# EAGLE design UL-16 (EAGLE 4.11)
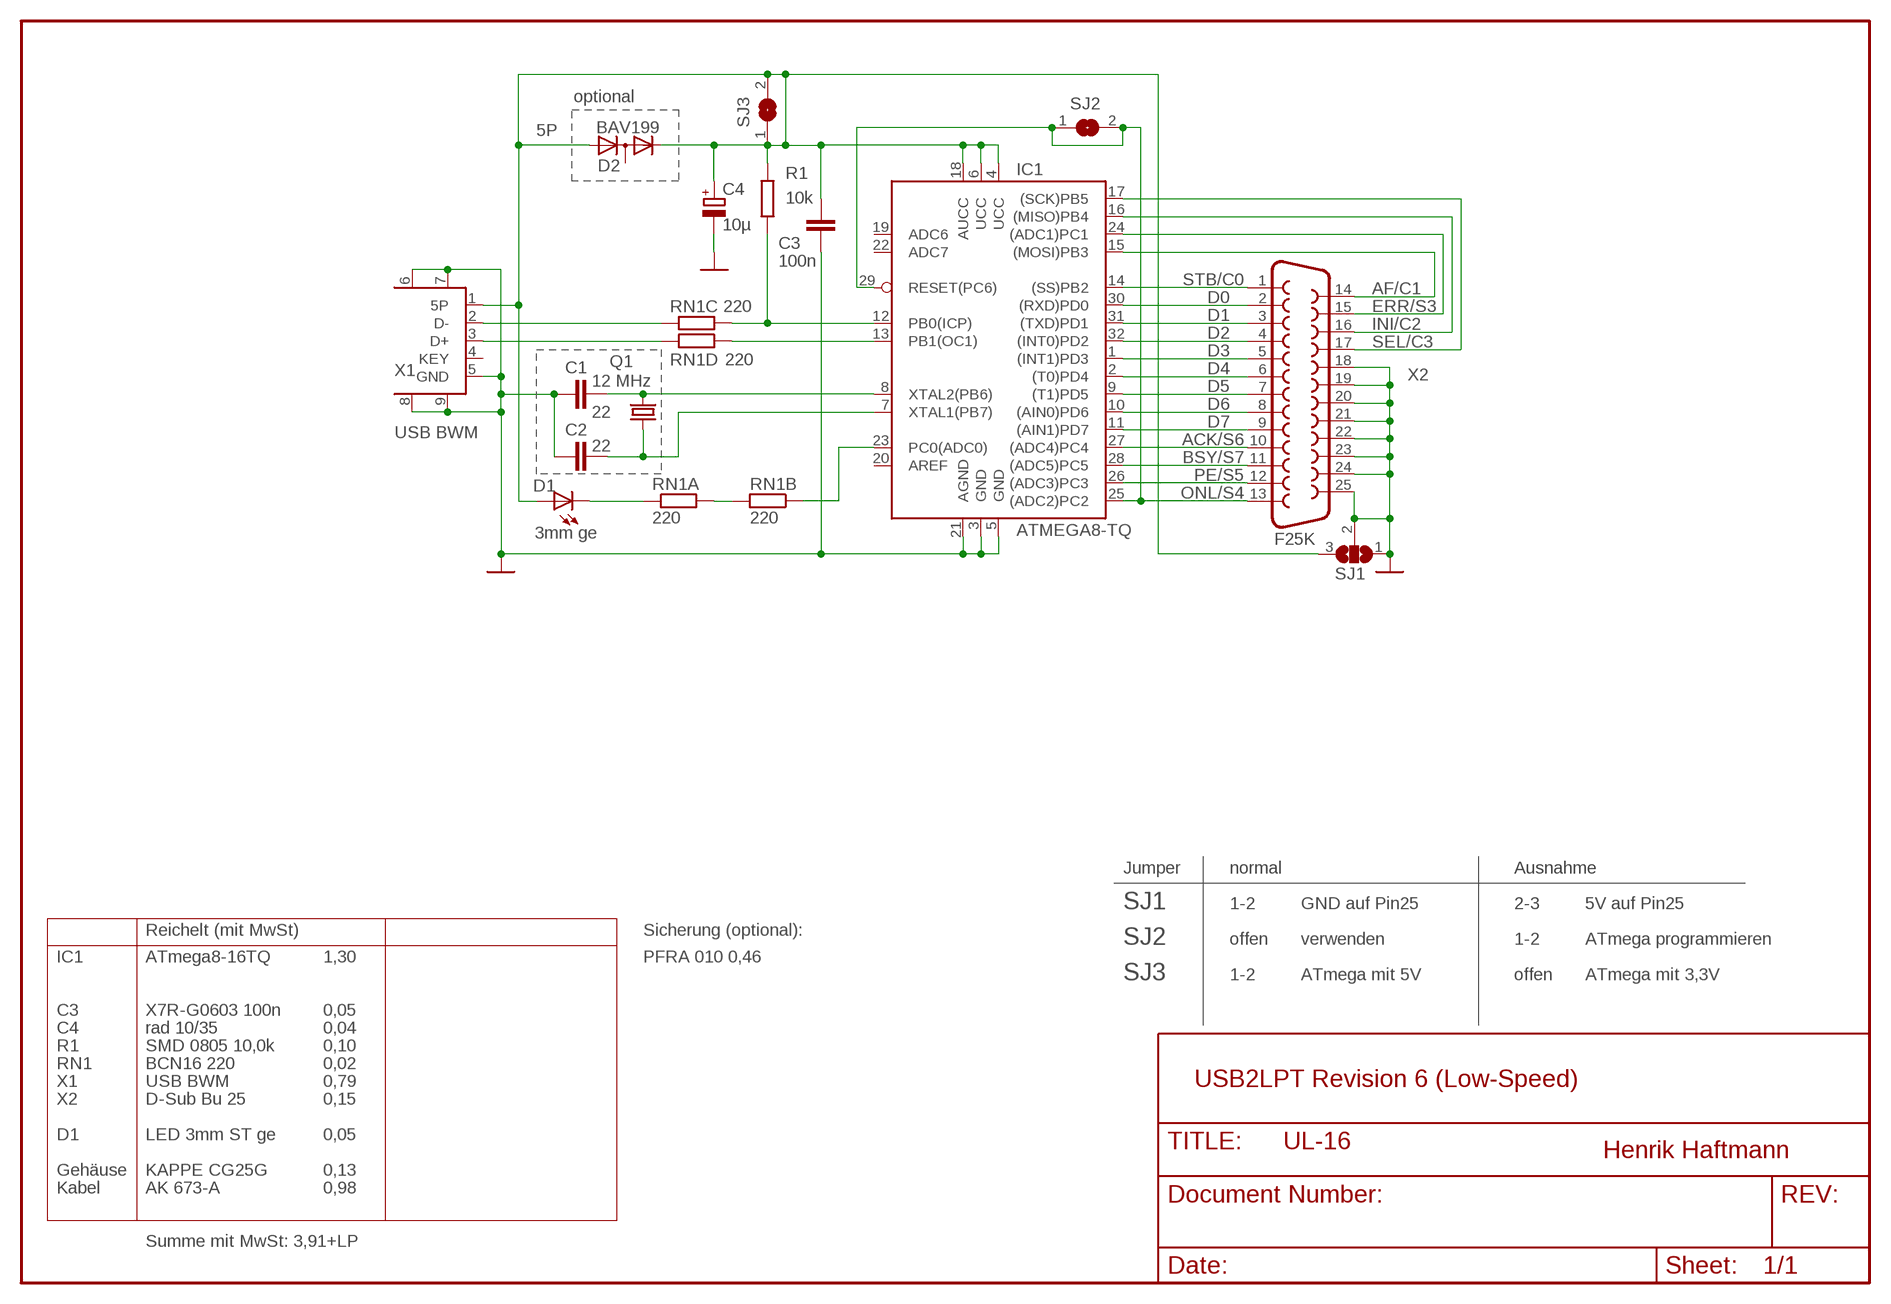
[diagram p0: schematic, sheet 1]

## Parts
C1  22  C-EUC0603  [C0603]
C2  22  C-EUC0603  [C0603]
C3  100n  C-EUC0603  [C0603]
C4  10µ  CPOL-EUTT2D5L  [TT2D5L]
D1  3mm ge  LED3MM  [LED3MM]
D2  BAV199  [SOT23]
IC1  ATMEGA8-TQ  [TQFP32-08]
Q1  12 MHz  CRYTALHC49U-V  [HC49U-V]
R1  10k  R-EU_R0805  [R0805]
RN1  220  RN-4P1206  [R-4P]
SJ1  SJ3P  [SJ3P]
SJ2  SJ2P  [SJ2P]
SJ3  SJ2P  [SJ2P]
X1  USB BWM  USB-MINIB-BO-E  [USB-MINIB-BU-E]
X2  F25K  [F25K]

## Nets
5P: C3.2 C4.+ D1.A D2.1(A) D2.2(C) IC1.4(UCC) IC1.6(UCC) IC1.18(AUCC) R1.2 SJ1.3 SJ3.1 SJ3.2 X1.1(5P)
ACK/S6: IC1.27((ADC4)PC4) X2.10
AF/C1: IC1.15((MOSI)PB3) X2.14
BSY/S7: IC1.28((ADC5)PC5) X2.11
D0: IC1.30((RXD)PD0) X2.2
D1: IC1.31((TXD)PD1) X2.3
D2: IC1.32((INT0)PD2) X2.4
D3: IC1.1((INT1)PD3) X2.5
D4: IC1.2((T0)PD4) X2.6
D5: IC1.9((T1)PD5) X2.7
D6: IC1.10((AIN0)PD6) X2.8
D7: IC1.11((AIN1)PD7) X2.9
D+: RN1.5 X1.3(D+)
D-: RN1.6 X1.2(D-)
ERR/S3: IC1.24((ADC1)PC1) X2.15
GND: C1.2 C2.2 C3.1 C4.- IC1.3(GND) IC1.5(GND) IC1.21(AGND) SJ1.1 SJ1.2 X1.5(GND) X1.6(GND) X1.7(GND) X1.8(GND) X1.9(GND) X2.18 X2.19 X2.20 X2.21 X2.22 X2.23 X2.24 X2.25
INI/C2: IC1.16((MISO)PB4) X2.16
LEDGELB: RN1.7 RN1.8
N$1: C2.1 IC1.7(XTAL1(PB7)) Q1.1
N$2: C1.1 IC1.8(XTAL2(PB6)) Q1.2
N$3: IC1.12(PB0(ICP)) R1.1 RN1.3
N$4: IC1.13(PB1(OC1)) RN1.4
N$6: IC1.23(PC0(ADC0)) RN1.2
N$7: D1.K RN1.1
ONL/S4: IC1.25((ADC2)PC2) IC1.29(RESET(PC6)) SJ2.1 SJ2.2 X2.13
PE/S5: IC1.26((ADC3)PC3) X2.12
SEL/C3: IC1.17((SCK)PB5) X2.17
STB/C0: IC1.14((SS)PB2) X2.1
Unconnected: D2.3(AC) IC1.19(ADC6) IC1.20(AREF) IC1.22(ADC7) X1.4(KEY)

## Notes on the sheet
- optional
- Jumper | normal | Ausnahme
- SJ1 | 1-2 | GND auf Pin25 | 2-3 | 5V auf Pin25
- Reichelt (mit MwSt) | Sicherung (optional):
- SJ2 | offen | verwenden | 1-2 | ATmega programmieren
- IC1 | ATmega8-16TQ | 1,30 | PFRA 010 0,46
- SJ3 | 1-2 | ATmega mit 5V | offen | ATmega mit 3,3V
- C3 | X7R-G0603 100n | 0,05
- C4 | rad 10/35 | 0,04
- R1 | SMD 0805 10,0k | 0,10
- RN1 | BCN16 220 | 0,02
- X1 | USB BWM | 0,79 | USB2LPT Revision 6 (Low-Speed)
- X2 | D-Sub Bu 25 | 0,15
- D1 | LED 3mm ST ge | 0,05
- Henrik Haftmann
- Gehäuse | KAPPE CG25G | 0,13
- Kabel | AK 673-A | 0,98
- Summe mit MwSt: 3,91+LP

## Library data of the parts
C1-C3 = rcl:C-EU: CAPACITOR, European symbol
C4 = rcl:CPOL-EU: POLARIZED CAPACITOR, European symbol
D1 = hs-ul:LED: Leuchtdiode 2 Anschlüsse
D2 = diode:BAV199: DIODE low-leakage double diode
IC1 = hs-ul:ATMEGA8-*: Mikrocontroller 8bit, 16MHz, Harvard 8 Kbyte FLASH (schreibbar durch Firmware) 1 KByte RAM 0,5 KByte EEPROM 1x UART, 8 Kanal 10-bit-ADU, 2x Timer, I²C, SPI Achtung! Chaotisches Schaltbild nur passend für USB2LPT 1.5
Q1 = crystal:CRYTAL: CRYSTAL
R1 = rcl:R-EU_: RESISTOR, European symbol
RN1 = hs-ul:RN-4P: Widerstandsnetzwerk 4 Parallel
SJ1 = hs-ul:SJ3P: Lötbrücke 3pol. Spaltbreite 0,15 mm
SJ2 SJ3 = hs-ul:SJ2P: Lötbrücke 2pol. Spaltbreite 0,15 mm
X1 = hs-ul:USB-MINIB-BO: USB MiniB-Buchse Oberflächenmontage (Zwei Varianten zur Kantenmontage)
X2 = hs-ul:F25: SubD-Buchse korrigiert und verschönert Kantenmontage Reichelt D-SUB BU 25 0,14€

## Board
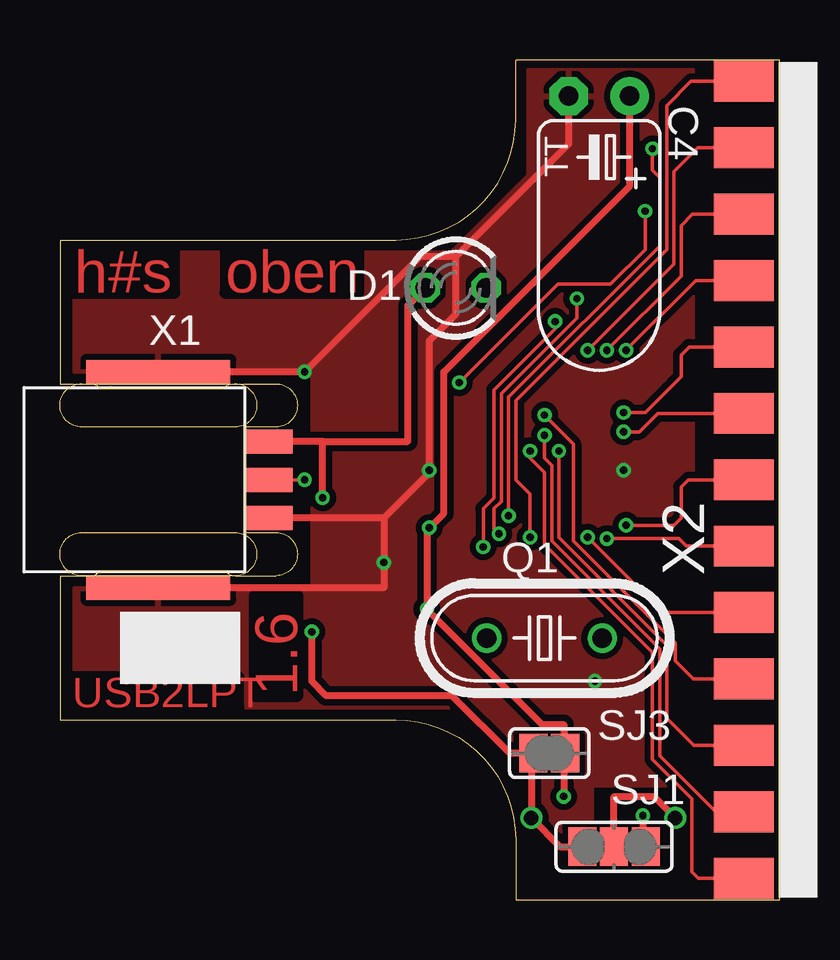
[diagram p1: board, top side]
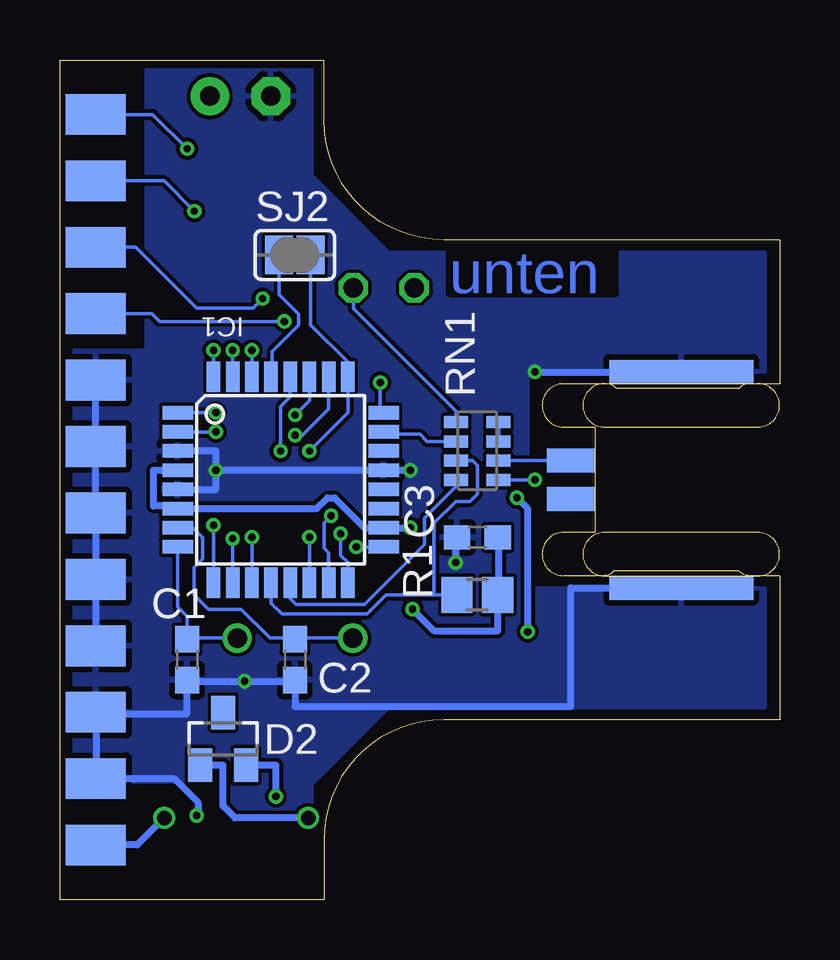
[diagram p2: board, bottom side, seen from below]

Size 30 x 35 mm. Coordinates in mm from the lower left corner, seen from the top.
Outline: 30,0 30,35 19,35 19,32.5 arc-90 14,27.5 0,27.5 0,21.5 1.25,21.5 arc-45 1.68,21.32 1.7,21.3 6.8,21.3 6.82,21.32 arc-45 7.25,21.5 9,21.5 arc-180 9,19.7 7.7,19.7 7.7,15.3 9,15.3 arc-180 9,13.5 7.33,13.5 arc-45 6.97,13.63 6.9,13.7 1.7,13.7 1.66,13.66 arc-45 1.13,13.5 0,13.5 0,7.5 14,7.5 arc-90 19,2.5 19,0 30,0
Copper layers (1*16): Top 0.035mm / dielectric 1.4mm / Bottom 0.035mm
Design rules "default": minimum track width 0.15mm, minimum drill 0.3mm, track to track 0.15mm, track to pad 0.15mm, pad to pad 0.15mm, via to via 0.15mm, smd to smd 0mil, copper to edge 0mil, drill to drill 0.15mm, minimum pad ring 0.15mm, minimum via ring 0.15mm, stop-mask expansion 4mil, vias tented up to drill 0.4mm, thermal gap 10mil
Milling: 8 lines

### Footprints (pad centres in the part's own frame; a part is rotated, then mirrored left to right if it is on the bottom)
C0603 = smd 1.1 x 1: 1 -0.85,0; 2 0.85,0
TT2D5L = drill 0.813 pad 1.6 round: + -1.27,0 | drill 0.813 pad 1.6 octagon: - 1.27,0
LED3MM = drill 0.813 octagon: A -1.27,0; K 1.27,0
SOT23 = smd 1 x 1.4: 1 -0.95,-1.1; 2 0.95,-1.1; 3 0,1.1
TQFP32-08 = smd 1.27 x 0.559: 1 -4.293,2.8; 2 -4.293,2; 3 -4.293,1.2; 4 -4.293,0.4; 5 -4.293,-0.4; 6 -4.293,-1.2; 7 -4.293,-2; 8 -4.293,-2.8; 17 4.293,-2.8; 18 4.293,-2; 19 4.293,-1.2; 20 4.293,-0.4; 21 4.293,0.4; 22 4.293,1.2; 23 4.293,2; 24 4.293,2.8 | smd 0.559 x 1.27: 9 -2.8,-4.293; 10 -2,-4.293; 11 -1.2,-4.293; 12 -0.4,-4.293; 13 0.4,-4.293; 14 1.2,-4.293; 15 2,-4.293; 16 2.8,-4.293; 25 2.8,4.293; 26 2,4.293; 27 1.2,4.293; 28 0.4,4.293; 29 -0.4,4.293; 30 -1.2,4.293; 31 -2,4.293; 32 -2.8,4.293
HC49U-V = drill 0.813 round: 1 -2.413,0; 2 2.413,0
R0805 = smd 1.3 x 1.5: 1 -0.85,0; 2 0.85,0
R-4P = smd 0.5 x 1: 1 -1.2,-0.88; 2 -0.4,-0.88; 3 0.4,-0.88; 4 1.2,-0.88; 5 1.2,0.88; 6 0.4,0.88; 7 -0.4,0.88; 8 -1.2,0.88
SJ3P = smd 1.168 x 1.6: 1 -1.324,0; 2 0,0; 3 1.324,0
SJ2P = smd 1.168 x 1.6: 1 -0.662,0; 2 0.662,0
USB-MINIB-BU-E = smd 2 x 1: 1 9.6,1.6; 3 9.6,0; 5 9.6,-1.6 | smd 2 x 1 bottom: 2 9.6,0.8; 4 9.6,-0.8 | smd 6 x 1 bottom: 6 5,4.5; 9 5,-4.5 | smd 6 x 1: 7 5,4.5; 8 5,-4.5
F25K = smd 1.7 x 2.5: 1 -16.612,-1.75; 2 -13.843,-1.75; 3 -11.074,-1.75; 4 -8.306,-1.75; 5 -5.537,-1.75; 6 -2.769,-1.75; 7 0,-1.75; 8 2.769,-1.75; 9 5.537,-1.75; 10 8.306,-1.75; 11 11.074,-1.75; 12 13.843,-1.75; 13 16.612,-1.75 | smd 1.7 x 2.5 bottom: 14 -15.227,-1.75; 15 -12.459,-1.75; 16 -9.69,-1.75; 17 -6.921,-1.75; 18 -4.153,-1.75; 19 -1.384,-1.75; 20 1.384,-1.75; 21 4.153,-1.75; 22 6.921,-1.75; 23 9.69,-1.75; 24 12.459,-1.75; 25 15.227,-1.75

### Placement (x,y rotation side)
C1  24.7,10 270 bottom
C2  20.2,10 270 bottom
C3  12.6,15.1 0 bottom
C4  22.48,33.49 180 top
D1  16.5,25.5 0 top
D2  23.2,6.7 0 bottom
IC1  20.8,17.5 0 bottom
Q1  20.2,10.9 0 top
R1  12.6,12.7 0 bottom
RN1  12.6,18.7 270 bottom
SJ1  23.1,2.2 180 top
SJ2  20.21,26.87 0 bottom
SJ3  20.4,6.1 180 top
X1  -0.9,17.5 0 top
X2  30.25,17.5 270 top

### Tracks (layer width: path | path; a pad name or v marks a point on that pad's centre or on a via)
5P  (via drill 0.3, 0.61)
  Top 0.15: SJ3.1 SJ3.2
  Top 0.3: 10.95,19.1 X1.1 | v10.95,16.75 10.95,19.1 | SJ1.3 20.85,2.2 v19.65,3.4 19.65,6.1 SJ3.2 18.75,6.1 16.35,8.5 11.1,8.5 10.5,9.1 v10.5,11.16 | 10.95,19.1 14.5,19.1 14.5,24.77 D1.A | 21,6.1 SJ3.1 | 21,6.1 21,7.3 20.1,7.3 v15.3,12.1 15.3,15.4 v15.4,15.5 16,16.1 16,22 23.75,29.75 C4.+ | 21,6.1 v21,4.3
  Bottom 0.15: IC1.6 25.09,16.34 25.15,16.4
  Bottom 0.3: v10.95,16.75 10.5,16.3 v10.5,11.16 | D2.1 23.2,5.6 23.2,3.9 22.7,3.4 v19.65,3.4 | IC1.6 19.3,16.3 18.85,16.75 18.55,16.75 17.3,15.5 IC1.18 v15.4,15.5 | C3.2 11.7,15.1 11.7,12.7 R1.2 11.75,11.2 11.8,11.2 14.4,11.2 v15.3,12.1 | 25.15,16.4 26.1,16.4 26.1,17.9 IC1.4 | D2.2 21,5.6 v21,4.3
ACK/S6  (via drill 0.3)
  Top 0.15: X2.10 26.41,9.19 25.65,9.95 25.65,10.7 21.4,14.95 21.4,19 v20.2,20.2
  Bottom 0.15: v20.2,20.2 19.6,20.8 19.6,21.7 19.65,21.75 IC1.27
AF/C1  (via drill 0.3)
  Top 0.15: v18.7,16 18.7,20.95 25,27.25 25,30.1 24.7,30.4 v24.7,31.3
  Bottom 0.15: v18.7,16 19,15.7 19,14.65 18.8,14.45 IC1.15 | X2.14 26.13,32.73 v24.7,31.3
BSY/S7  (via drill 0.3)
  Top 0.15: X2.11 26.42,6.43 25.3,7.55 25.3,10.6 20.8,15.1 v20.8,18.7
  Bottom 0.15: v20.8,18.7 20.8,20.55 20.4,20.95 IC1.28
D0  (via drill 0.3)
  Top 0.15: X2.2 26.59,31.34 25.6,30.35 25.6,26.5 v22,22.9
  Bottom 0.15: v22,22.9 IC1.30
D1  (via drill 0.3)
  Top 0.15: v22.8,22.9 25.9,26 25.9,28.1 26.37,28.57 X2.3
  Bottom 0.15: v22.8,22.9 IC1.31
D2  (via drill 0.3)
  Top 0.15: X2.4 26.51,25.81 v23.6,22.9
  Bottom 0.15: v23.6,22.9 IC1.32
D3  (via drill 0.3)
  Top 0.15: X2.5 26.24,23.04 25.9,22.7 25.9,21.8 24.4,20.3 v23.5,20.3
  Bottom 0.15: IC1.1 v23.5,20.3
D4  (via drill 0.3)
  Top 0.15: X2.6 24.92,20.27 24.15,19.5 v23.5,19.5
  Bottom 0.15: IC1.2 v23.5,19.5
D5  (via drill 0.3)
  Top 0.15: X2.7 26.2,17.5 25.9,17.2 25.9,15.9 25.6,15.6 v23.6,15.6
  Bottom 0.15: IC1.9 23.6,13.3 23.55,13.35 23.6,13.4 v23.6,15.6
D6  (via drill 0.3)
  Top 0.15: v22.8,15.05 25.8,15.05 26.12,14.73 X2.8
  Bottom 0.15: IC1.10 22.8,13.35 22.75,13.4 22.8,13.45 v22.8,15.05
D7  (via drill 0.3)
  Top 0.15: X2.9 25.14,11.96 v22,15.1
  Bottom 0.15: IC1.11 21.95,13.25 22,13.3 v22,15.1
D+  (via drill 0.3)
  Top 0.15: v10.2,17.5 X1.3
  Bottom 0.15: RN1.5 v10.2,17.5
D-
  Bottom 0.15: RN1.6 X1.2
ERR/S3  (via drill 0.3)
  Top 0.15: v16.65,21.55 20.75,25.65 22.95,25.65 24.4,27.1 v24.4,28.7
  Bottom 0.15: X2.15 25.66,29.96 v24.4,28.7 | IC1.24 16.65,20.3 v16.65,21.55
GND  (via drill 0.3, 0.61)
  Top 0.15: SJ1.2 24.3,2.2 SJ1.1
  Top 0.3: 13.5,15.9 15.4,17.8 v15.4,17.9 15.4,23.3 16.5,24.4 16.5,26.8 | 13.5,15.9 v13.5,14.05 13.5,13 X1.8 | 13.5,15.9 X1.5 | v24.3,3.5 24.3,2.2 | 16.5,26.8 15,26.8 v10.2,22 X1.7 | C4.- 21.21,31.51 16.5,26.8 | v25.65,3.4 24.75,4.3 23.1,4.3 SJ1.2
  Bottom 0.15: IC1.3 25.15,18.65 25.2,18.7 | 28.5,19.05 28.45,19 28.5,18.95 X2.19 28.5,18.85 | X2.21 28.45,13.35 | X2.23
  Bottom 0.3: IC1.3 23.5,18.7 v23.5,17.9 | v23.5,17.9 23.5,17.1 IC1.5 | v23.5,17.9 IC1.21 v15.4,17.9 | C3.1 13.5,15.1 v13.5,14.05 | v24.3,3.5 24.25,3.5 24.25,4.05 25.25,5.05 27,5.05 | 28.5,7.9 | X2.23 28.5,7.75 | 28.5,7.75 X2.24 | X2.24 | X1.8 8.7,13 8.7,8.05 20.2,8.05 C2.2 20.2,9.1 v22.3,9.1 24.7,9.1 | X2.23 | 28.5,7.9 X2.23 | v10.2,22 X1.7 | 24.7,9.1 C1.2 | 24.7,9.1 24.7,7.75 28.5,7.75 | X2.24 | 26.89,5.05 26.89,5.04 26.99,5.04 27,5.05 | 28.5,7.9 | X2.24 27,5.05 | X2.24 | 28.5,7.9 | X2.25 26.78,2.27 v25.65,3.4 | 28.5,19.05 X2.18 | 28.5,18.85 X2.20 X2.21 X2.22
  pour Top (isolate 0.254, rank 2): 0.6,27 0.6,22 10.5,22 10.5,13 0.6,13 0.6,8 16.3,8 19.5,4.8 19.5,0.4 22.2,0.4 22.2,4.75 26.4,4.75 26.4,34.6 19.5,34.6 19.5,30.2 16.3,27
  pour Bottom: 26.4,34.6 19.5,34.6 19.5,30.2 16.3,27 0.6,27 0.6,22 10.5,22 10.5,13 0.6,13 0.6,8 16.3,8 19.5,4.8 19.5,0.4 23.15,0.4 23.15,4.9 29.4,4.9 29.4,22.9 26.4,22.9
INI/C2  (via drill 0.3)
  Top 0.15: v21.55,25.05 21.55,24.25 18.4,21.1 18.4,16.6 18.1,16.3 18.1,15.45 v18.3,15.25
  Bottom 0.15: X2.16 26.84,27.19 24.3,24.65 21.95,24.65 v21.55,25.05 | v18.3,15.25 18.3,14.35 18,14.05 18,13.4 18.05,13.35 18,13.3 IC1.16
LEDGELB
  Bottom 0.15: RN1.8 11.7,19.9 11.7,19.1 RN1.7
N$1
  Bottom 0.15: IC1.7 24.45,15.5 24.05,15.1 24.05,14.2 24.4,13.85 24.4,12.7 23.8,12.1 22.45,12.1 21.25,10.9 20.2,10.9 | 20.2,10.8 C2.1 20.2,10.9 | 20.2,10.9 Q1.1
N$2
  Bottom 0.15: Q1.2 24.7,10.9 C1.1 24.7,11.8 25.09,12.19 IC1.8
N$3
  Bottom 0.15: RN1.3 12.8,18.3 12.6,18.1 12.6,16.9 12.9,16.6 13.5,16.6 14.4,15.7 14.4,12.7 | IC1.12 21.2,12.35 20.75,11.9 17.2,11.9 16.4,12.7 14.4,12.7 | 14.4,12.7 R1.1
N$4
  Bottom 0.15: RN1.4 13.48,17.22 14.8,15.9 14.8,14.8 17.3,12.3 20.15,12.3 20.4,12.55 IC1.13
N$6
  Bottom 0.15: RN1.2 14.7,19.1 15,19.4 16.2,19.4 16.3,19.5 IC1.23
N$7
  Bottom 0.15: D1.K 17.77,24.63 13.49,20.36 | 13.49,20.36 13.49,20.35 | 13.49,20.35 13.5,20.35 | 13.49,20.36 13.49,20.35 | RN1.1 13.48,20.35 13.49,20.35
ONL/S4  (via drill 0.3)
  Top 0.15: v19.6,18.7 19.6,18.4 20.2,17.8 20.2,14.8 24.7,10.3 24.7,5.85 26.35,4.2 26.35,1.15 26.61,0.89 X2.13
  Bottom 0.15: IC1.29 21.2,22 21.15,22.05 21.15,22.85 20.05,23.95 20.05,24.4 20.87,25.22 SJ2.1 20.87,26.85 19.55,26.85 SJ2.2 19.55,23.95 18,22.4 IC1.25 18,20.3 v19.6,18.7
PE/S5  (via drill 0.3)
  Top 0.15: X2.12 27.34,3.66 25,6 25,10.45 20.5,14.95 20.5,18.1 20.2,18.4 v20.2,19.35
  Bottom 0.15: IC1.26 18.8,20.45 19.9,19.35 v20.2,19.35
SEL/C3  (via drill 0.3)
  Top 0.15: v20.65,24.1 20.65,23.8 18.1,21.25 18.1,16.75 17.65,16.3 v17.65,14.7
  Bottom 0.15: X2.17 26.17,24.42 25.85,24.1 v20.65,24.1 | IC1.17 16.55,14.7 16.6,14.75 16.65,14.7 v17.65,14.7
STB/C0  (via drill 0.3)
  Top 0.15: X2.1 26.31,34.11 25.3,33.1 25.3,27.1 19,20.8 19,17.5 19.6,16.9 v19.6,15.1
  Bottom 0.15: v19.6,15.1 IC1.14

### Text on the board
Top: h#s | oben | 1.6 | USB2LPT
Bottom: unten
Measures: 8 | 35 | 20 | R5 | 11 | 30